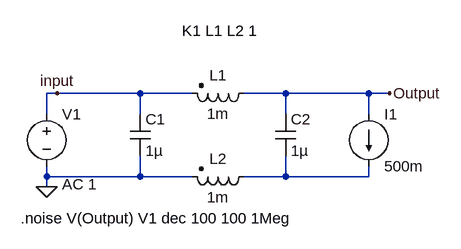
[diagram p0: schematic LC-Filter_2.asc]
LC-Filter_2.asc, the LTspice schematic file:
Version 4
SHEET 1 880 680
WIRE 16 128 0 128
WIRE 144 128 16 128
WIRE 224 128 144 128
WIRE 368 128 304 128
WIRE 496 128 368 128
WIRE 528 128 496 128
WIRE 0 160 0 128
WIRE 144 160 144 128
WIRE 368 160 368 128
WIRE 496 160 496 128
WIRE 0 256 0 240
WIRE 144 256 144 224
WIRE 144 256 0 256
WIRE 224 256 144 256
WIRE 368 256 368 224
WIRE 368 256 304 256
WIRE 496 256 496 240
WIRE 496 256 368 256
WIRE 0 272 0 256
FLAG 528 128 Output
FLAG 0 272 0
FLAG 16 128 input
SYMBOL voltage 0 144 R0
WINDOW 123 24 124 Left 2
WINDOW 39 0 0 Left 0
SYMATTR Value2 AC 1
SYMATTR InstName V1
SYMATTR Value ""
SYMBOL cap 352 160 R0
SYMATTR InstName C2
SYMATTR Value 1µ
SYMATTR SpiceLine Rser=10
SYMBOL ind2 320 112 R90
WINDOW 0 4 56 VBottom 2
WINDOW 3 32 56 VTop 2
SYMATTR InstName L1
SYMATTR Value 1m
SYMATTR Type ind
SYMBOL current 496 160 R0
WINDOW 123 0 0 Left 0
WINDOW 39 0 0 Left 0
SYMATTR InstName I1
SYMATTR Value 500m
SYMBOL ind2 320 240 R90
WINDOW 0 4 56 VBottom 2
WINDOW 3 32 56 VTop 2
SYMATTR InstName L2
SYMATTR Value 1m
SYMATTR Type ind
SYMBOL cap 128 160 R0
SYMATTR InstName C1
SYMATTR Value 1µ
SYMATTR SpiceLine Rser=10
TEXT -40 320 Left 2 !.noise V(Output) V1 dec 100 100 1Meg
TEXT 208 32 Left 2 !K1 L1 L2 1

The netlist it stands for:
* LC-Filter_2.asc
V1 input 0 AC 1
C2 Output N001 1µ Rser=10
L1 Output input 1m
I1 Output N001 500m
L2 N001 0 1m
C1 input 0 1µ Rser=10
.noise V(Output) V1 dec 100 100 1Meg
K1 L1 L2 1
.backanno
.end